# Altium schematic sheet usbserial.SchDoc
size A4
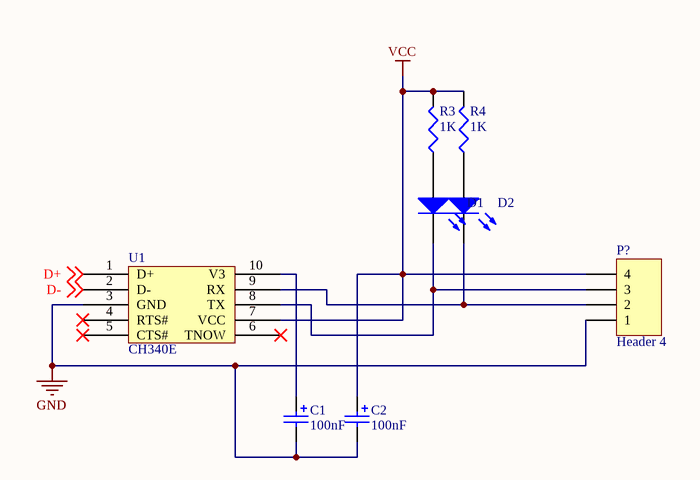
[diagram p0: usbserial.SchDoc]

## Parts
C1  value 100nF  [0805]  (hidden comment: Cap Pol2)
C2  value 100nF  [0805]  (hidden comment: Cap Pol2)
D1  LED2  [0805]  (value not drawn)
D2  LED2  [0805]  (value not drawn)
P?  Header 4  [HDR1X4]
R3  value 1K  [0805]  (hidden comment: Res3)
R4  value 1K  [0805]  (hidden comment: Res3)
U1  CH340E  [SLAB-MSOP-10_L]

## Nets
GND: C1.2 C2.2 P?.1 U1.3(GND)
VCC: C2.1 P?.4 R3.2 R4.2 U1.7(VCC)
D+: U1.1(D+) ; off-sheet D+
D-: U1.2(D-) ; off-sheet D-
NetC1_1: C1.1 U1.10(V3)
NetD1_1: D1.1(A) R3.1
NetD1_2: D1.2(K) P?.3 U1.8(TX)
NetD2_1: D2.1(A) R4.1
NetD2_2: D2.2(K) P?.2 U1.9(RX)

Not connected (* = marked no-connect by the designer): U1 4(RTS#)* 5(CTS#)* 6(TNOW)*

## Library data of the parts
C1 C2 = Cap Pol2: Polarized Capacitor (Axial); Published: 8-Jun-2000; LatestRevisionDate: 17-Jul-2002; LatestRevisionNote: Re-released for DXP Platform.; PackageReference: POLAR0.8; Publisher: Altium Limited; PackageDescription: Polarized Capacitor; 2 Leads
D1 D2 = LED2: Typical RED, GREEN, YELLOW, AMBER GaAs LED; Published: 8-Jun-2000; LatestRevisionDate: 17-Jul-2002; LatestRevisionNote: Re-released for DXP Platform.; PackageVersion: Feb-2002; PackageReference: 3.2X1.6X1.1; Publisher: Altium Limited; PackageDescription: SM LED; 2 Flat Leads
P? = Header 4: Header, 4-Pin; LatestRevisionDate: 17-Jul-2002; LatestRevisionNote: Re-released for DXP Platform.; Publisher: Altium Limited
R3 R4 = Res3: Resistor; Published: 8-Jun-2000; LatestRevisionDate: 29-May-2009; LatestRevisionNote: IPC-7351 Footprint Added.; PackageReference: J1-0603; Publisher: Altium Limited; PackageDescription: Chip Resistor
U1 = CH340E: TTL IC